# Altium schematic sheet di.SchDoc
size A2
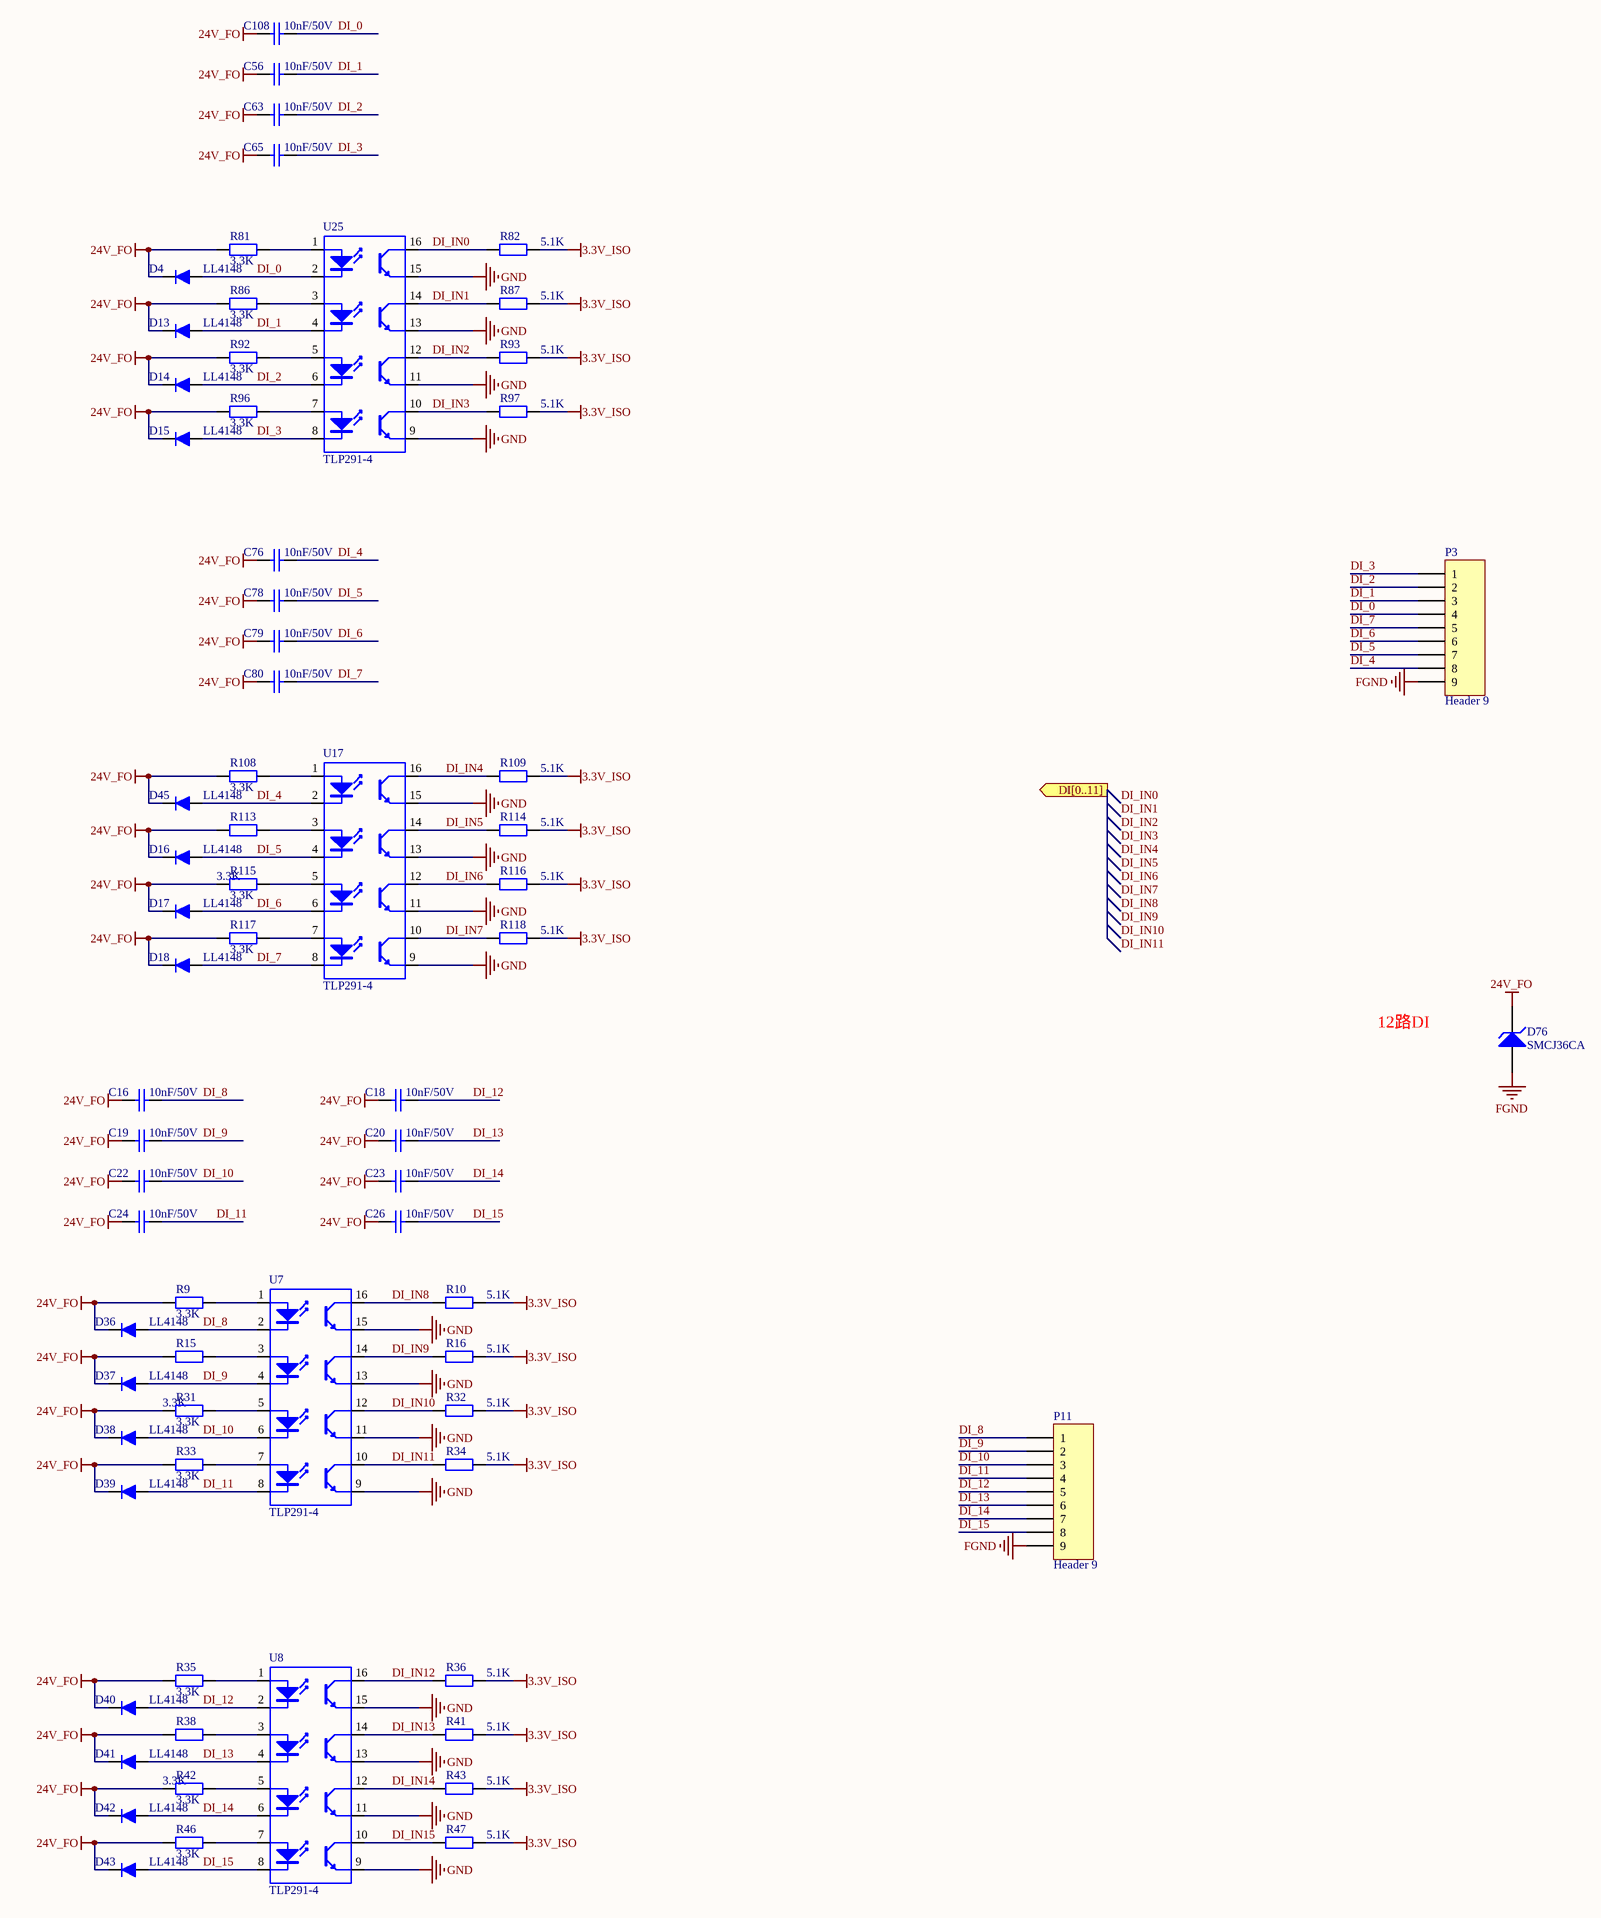
[diagram p0: di.SchDoc]

## Parts
C16  10nF/50V  [0603C]
C18  10nF/50V  [0603C]
C19  10nF/50V  [0603C]
C20  10nF/50V  [0603C]
C22  10nF/50V  [0603C]
C23  10nF/50V  [0603C]
C24  10nF/50V  [0603C]
C26  10nF/50V  [0603C]
C56  10nF/50V  [0603C]
C63  10nF/50V  [0603C]
C65  10nF/50V  [0603C]
C76  10nF/50V  [0603C]
C78  10nF/50V  [0603C]
C79  10nF/50V  [0603C]
C80  10nF/50V  [0603C]
C108  10nF/50V  [0603C]
D4  LL4148  [DO-213AB/LL34/MiniMELF]
D13  LL4148  [DO-213AB/LL34/MiniMELF]
D14  LL4148  [DO-213AB/LL34/MiniMELF]
D15  LL4148  [DO-213AB/LL34/MiniMELF]
D16  LL4148  [DO-213AB/LL34/MiniMELF]
D17  LL4148  [DO-213AB/LL34/MiniMELF]
D18  LL4148  [DO-213AB/LL34/MiniMELF]
D36  LL4148  [DO-213AB/LL34/MiniMELF]
D37  LL4148  [DO-213AB/LL34/MiniMELF]
D38  LL4148  [DO-213AB/LL34/MiniMELF]
D39  LL4148  [DO-213AB/LL34/MiniMELF]
D40  LL4148  [DO-213AB/LL34/MiniMELF]
D41  LL4148  [DO-213AB/LL34/MiniMELF]
D42  LL4148  [DO-213AB/LL34/MiniMELF]
D43  LL4148  [DO-213AB/LL34/MiniMELF]
D45  LL4148  [DO-213AB/LL34/MiniMELF]
D76  SMCJ36CA  [smc]
P3  Header 9  [2ETYR-5.08-09P-14-100]
P11  Header 9  [2ETYR-5.08-09P-14-100]
R9  3.3K  [0603R]
R10  5.1K  [0603R]
R15  3.3K  [0603R]
R16  5.1K  [0603R]
R31  3.3K  [0603R]
R32  5.1K  [0603R]
R33  3.3K  [0603R]
R34  5.1K  [0603R]
R35  3.3K  [0603R]
R36  5.1K  [0603R]
R38  3.3K  [0603R]
R41  5.1K  [0603R]
R42  3.3K  [0603R]
R43  5.1K  [0603R]
R46  3.3K  [0603R]
R47  5.1K  [0603R]
R81  3.3K  [0603R]
R82  5.1K  [0603R]
R86  3.3K  [0603R]
R87  5.1K  [0603R]
R92  3.3K  [0603R]
R93  5.1K  [0603R]
R96  3.3K  [0603R]
R97  5.1K  [0603R]
R108  3.3K  [0603R]
R109  5.1K  [0603R]
R113  3.3K  [0603R]
R114  5.1K  [0603R]
R115  3.3K  [0603R]
R116  5.1K  [0603R]
R117  3.3K  [0603R]
R118  5.1K  [0603R]
U7  TLP291-4  [SOP16-T]
U8  TLP291-4  [SOP16-T]
U17  TLP291-4  [SOP16-T]
U25  TLP291-4  [SOP16-T]

## Ports
DI[0..11] (out)

## Nets
3.3V_ISO: R10.1 R16.1 R32.1 R34.1 R36.1 R41.1 R43.1 R47.1 R82.1 R87.1 R93.1 R97.1 R109.1 R114.1 R116.1 R118.1
24V_FO: C16.1 C18.1 C19.1 C20.1 C22.1 C23.1 C24.1 C26.1 C56.1 C63.1 C65.1 C76.1 C78.1 C79.1 C80.1 C108.1 D4.2 D13.2 D14.2 D15.2 D16.2 D17.2 D18.2 D36.2 D37.2 D38.2 D39.2 D40.2 D41.2 D42.2 D43.2 D45.2 D76.2(K) R9.2 R15.2 R31.2 R33.2 R35.2 R38.2 R42.2 R46.2 R81.2 R86.2 R92.2 R96.2 R108.2 R113.2 R115.2 R117.2
FGND: D76.1(A) P3.9 P11.9
GND: U7.9(E) U7.11(E) U7.13(E) U7.15(E) U8.9(E) U8.11(E) U8.13(E) U8.15(E) U17.9(E) U17.11(E) U17.13(E) U17.15(E) U25.9(E) U25.11(E) U25.13(E) U25.15(E)
DI_0: C108.2 D4.1 P3.4 U25.2(K)
DI_1: C56.2 D13.1 P3.3 U25.4(K)
DI_2: C63.2 D14.1 P3.2 U25.6(K)
DI_3: C65.2 D15.1 P3.1 U25.8(K)
DI_4: C76.2 D45.1 P3.8 U17.2(K)
DI_5: C78.2 D16.1 P3.7 U17.4(K)
DI_6: C79.2 D17.1 P3.6 U17.6(K)
DI_7: C80.2 D18.1 P3.5 U17.8(K)
DI_8: C16.2 D36.1 P11.1 U7.2(K)
DI_9: C19.2 D37.1 P11.2 U7.4(K)
DI_10: C22.2 D38.1 P11.3 U7.6(K)
DI_11: C24.2 D39.1 P11.4 U7.8(K)
DI_12: C18.2 D40.1 P11.5 U8.2(K)
DI_13: C20.2 D41.1 P11.6 U8.4(K)
DI_14: C23.2 D42.1 P11.7 U8.6(K)
DI_15: C26.2 D43.1 P11.8 U8.8(K)
DI_IN0: R82.2 U25.16(C)
DI_IN1: R87.2 U25.14(C)
DI_IN2: R93.2 U25.12(C)
DI_IN3: R97.2 U25.10(C)
DI_IN4: R109.2 U17.16(C)
DI_IN5: R114.2 U17.14(C)
DI_IN6: R116.2 U17.12(C)
DI_IN7: R118.2 U17.10(C)
DI_IN8: R10.2 U7.16(C)
DI_IN9: R16.2 U7.14(C)
DI_IN10: R32.2 U7.12(C)
DI_IN11: R34.2 U7.10(C)
DI_IN12: R36.2 U8.16(C)
DI_IN13: R41.2 U8.14(C)
DI_IN14: R43.2 U8.12(C)
DI_IN15: R47.2 U8.10(C)
NetR9_1: R9.1 U7.1(A)
NetR15_1: R15.1 U7.3(A)
NetR31_1: R31.1 U7.5(A)
NetR33_1: R33.1 U7.7(A)
NetR35_1: R35.1 U8.1(A)
NetR38_1: R38.1 U8.3(A)
NetR42_1: R42.1 U8.5(A)
NetR46_1: R46.1 U8.7(A)
NetR81_1: R81.1 U25.1(A)
NetR86_1: R86.1 U25.3(A)
NetR92_1: R92.1 U25.5(A)
NetR96_1: R96.1 U25.7(A)
NetR108_1: R108.1 U17.1(A)
NetR113_1: R113.1 U17.3(A)
NetR115_1: R115.1 U17.5(A)
NetR117_1: R117.1 U17.7(A)

## Notes on the sheet
- 12路DI
- Labels drawn without touching a wire or pin: DI_IN0, DI_IN1, DI_IN2, DI_IN3, DI_IN4, DI_IN5, DI_IN6, DI_IN7, DI_IN8, DI_IN9, DI_IN10, DI_IN11

## Library data of the parts
C16 C18-C20 C22-C24 C26 C56 C63 C65 C76 C78-C80 C108 = Cap: Capacitor; Value: 22nF; Published: 8-Jun-2000; LatestRevisionDate: 17-Jul-2002; LatestRevisionNote: Re-released for DXP Platform.; PackageReference: RAD-0.3; Publisher: Altium Limited; PackageDescription: Radial Cap, Thru-Hole; 2 Leads; 0.3 in Pin Spacing
D4 D13-D18 D36-D43 D45 = LL4148: VISHAY,LL4148,圆柱体MiniMELF100V/2A,ROHS; 版本: V1.00; 名称: 快速开关二极管; 物料编号: APLLY; 制造商: VISHAY
D76 = D Zener: SMBJ36CA; Published: 8-Jun-2000; LatestRevisionDate: 17-Jul-2002; LatestRevisionNote: Re-released for DXP Platform.; PackageReference: DIODE-0.7; Publisher: Altium Limited
P3 P11 = Header 9: Header, 9-Pin; LatestRevisionDate: 17-Jul-2002; LatestRevisionNote: Re-released for DXP Platform.; Publisher: Altium Limited
R9 R10 R15 R16 R31-R36 R38 R41-R43 R46 R47 R81 R82 R86 R87 R92 R93 R96 R97 R108 R109 R113-R118 = Res0805M
U7 U8 U17 U25 = TLP281-4